# EAGLE design Segger_JTAG_OptoIso_v1p4 (EAGLE 9.6.2)
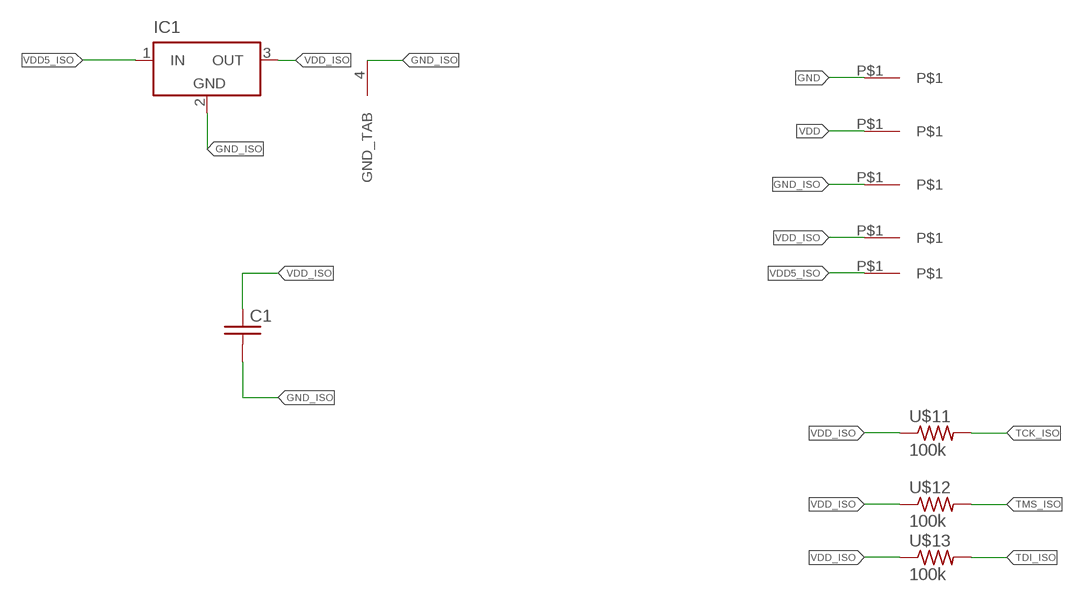
[diagram p0: schematic, sheet 1, part 1 of 2]
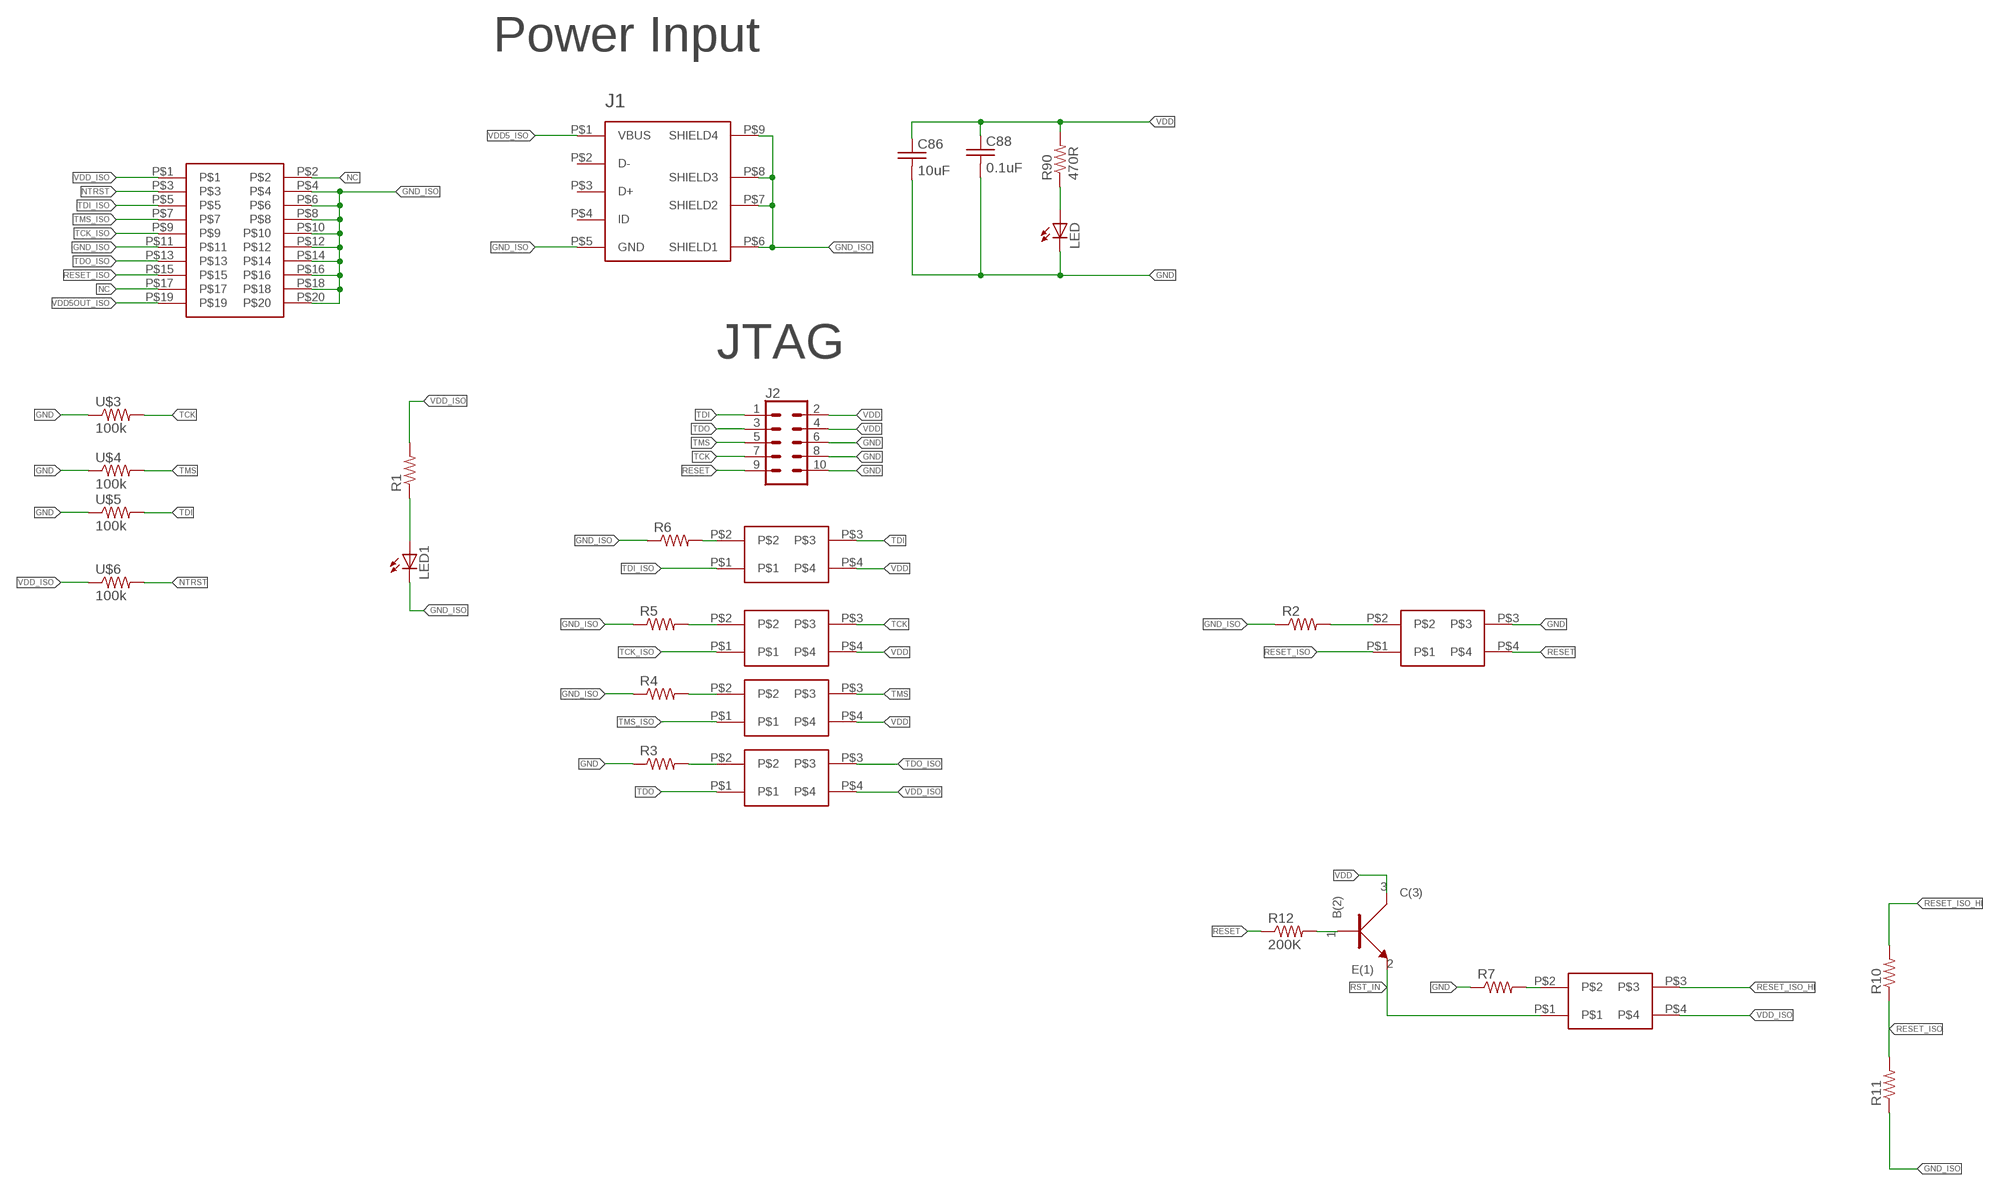
[diagram p1: schematic, sheet 1, part 2 of 2]

## Parts
C1  C_0805  [0805]
C86  10uF  C_0805  [0805]
C88  0.1uF  C_0805  [0805]
IC1  LT1129CST3  [SOT223]
J1  USB_MICRO-B  [USB_MICRO-B]
J2  CONN_05X2PTH  [2X5]
LED  LED_0805_GREEN  [LED_0805_GREEN]
LED1  LED_0805_GREEN  [LED_0805_GREEN]
P1  1_X_1_1MM_PIN  [1_X_1_1MM_PIN]
P2  1_X_1_1MM_PIN  [1_X_1_1MM_PIN]
P3  1_X_1_1MM_PIN  [1_X_1_1MM_PIN]
P4  1_X_1_1MM_PIN  [1_X_1_1MM_PIN]
P5  1_X_1_1MM_PIN  [1_X_1_1MM_PIN]
R1  R_0805  [0805]
R2  R_0805  [0805]
R3  R_0805  [0805]
R4  R_0805  [0805]
R5  R_0805  [0805]
R6  R_0805  [0805]
R7  R_0805  [0805]
R10  R_0805  [0805]
R11  R_0805  [0805]
R12  200K  R_0402  [0402]
R90  470R  R_0805  [0805]
U4  BC846BW  [SOT323]
U$1  OPTCOUPLER_PS2501L-1  [OPTOCOUPLER_PS2501L-1]
U$2  2_X_10_HEADER_GENERIC  [2_X_10_.1_INCH]
U$3  100k  R_0805  [0805]
U$4  100k  R_0805  [0805]
U$5  100k  R_0805  [0805]
U$6  100k  R_0805  [0805]
U$7  OPTCOUPLER_PS2501L-1  [OPTOCOUPLER_PS2501L-1]
U$8  OPTCOUPLER_PS2501L-1  [OPTOCOUPLER_PS2501L-1]
U$9  OPTCOUPLER_PS2501L-1  [OPTOCOUPLER_PS2501L-1]
U$10  OPTCOUPLER_PS2501L-1  [OPTOCOUPLER_PS2501L-1]
U$11  100k  R_0805  [0805]
U$12  100k  R_0805  [0805]
U$13  100k  R_0805  [0805]
U$14  OPTCOUPLER_PS2501L-1  [OPTOCOUPLER_PS2501L-1]

## Nets
GND: C86.2 C88.2 J2.6 J2.8 J2.10 LED.C P1.P$1 R3.1 R7.1 U$3.1 U$4.1 U$5.1 U$10.P$3
GND_ISO: C1.2 IC1.2(GND) IC1.4(GND_TAB) J1.P$5(GND) J1.P$6(SHIELD1) J1.P$7(SHIELD2) J1.P$8(SHIELD3) J1.P$9(SHIELD4) LED1.C P3.P$1 R2.1 R4.1 R5.1 R6.1 R11.1 U$2.P$4 U$2.P$6 U$2.P$8 U$2.P$10 U$2.P$11 U$2.P$12 U$2.P$14 U$2.P$16 U$2.P$18 U$2.P$20
N$1: LED1.A R1.1
N$2: R6.2 U$1.P$2
N$3: R5.2 U$7.P$2
N$4: R4.2 U$8.P$2
N$5: R3.2 U$9.P$2
N$6: R2.2 U$10.P$2
N$7: LED.A R90.1
N$8: R7.2 U$14.P$2
N$9: R12.P$2 U4.1(B(2))
NC: U$2.P$2 U$2.P$17
NTRST: U$2.P$3 U$6.2
RESET: J2.9 R12.P$1 U$10.P$4
RESET_ISO: R10.1 R11.2 U$2.P$15 U$10.P$1
RESET_ISO_HI: R10.2 U$14.P$3
RST_IN: U4.2(E(1)) U$14.P$1
TCK: J2.7 U$3.2 U$7.P$3
TCK_ISO: U$2.P$9 U$7.P$1 U$11.2
TDI: J2.1 U$1.P$3 U$5.2
TDI_ISO: U$1.P$1 U$2.P$5 U$13.2
TDO: J2.3 U$9.P$1
TDO_ISO: U$2.P$13 U$9.P$3
TMS: J2.5 U$4.2 U$8.P$3
TMS_ISO: U$2.P$7 U$8.P$1 U$12.2
VDD: C86.1 C88.1 J2.2 J2.4 P2.P$1 R90.2 U4.3(C(3)) U$1.P$4 U$7.P$4 U$8.P$4
VDD5_ISO: IC1.1(IN) J1.P$1(VBUS) P5.P$1
VDD5OUT_ISO: U$2.P$19
VDD_ISO: C1.1 IC1.3(OUT) P4.P$1 R1.2 U$2.P$1 U$6.1 U$9.P$4 U$11.1 U$12.1 U$13.1 U$14.P$4
Unconnected: J1.P$2(D-) J1.P$3(D+) J1.P$4(ID)

## Notes on the sheet
- Power Input
- JTAG

## Library data of the parts
C1 C86 C88 = 3D_MIG_Controller:C_0805
IC1 = 3D_MIG_Controller:LT1129CST3: VOLTAGE REGULATOR with shutdown
J1 = 3D_MIG_Controller:USB_MICRO-B
J2 = 3D_MIG_Controller:CONN_05X2: Multi connection point. Often used as Generic Header-pin footprint for 0.1 inch spaced/style header connections For AVR SPI programming port, see special device with nice symbol: "AVR_SPI_PROG_5x2.dev" You can populate with any combo of single row headers, but if you'd like an exact match, check these: 2x5 AVR ICSP Male Header <https://www.sparkfun.com/products/778> (PRT-00778) 2x5 Pin Shrouded Header <https://www.sparkfun.com/products/8506> (PRT-08506) On any of the 0.1 inch spaced packages, you can populate with these: Break Away Headers - Straight <https://www.sparkfun.com/products/116> (PRT-00116) Break Away Male Headers - Right Angle <https://www.sparkfun.com/products/553> (PRT-00553) Female Headers <https://www.sparkfun.com/products/115> (PRT-00115) Break Away Headers - Machine Pin <https://www.sparkfun.com/products/117> (PRT-00117) Break Away Female Headers - Swiss Machine Pin <https://www.sparkfun.com/products/743> (PRT-00743) Special note: the shrouded connector mates well with our 5x2 ribbon cables: 2x5 Pin IDC Ribbon Cable <https://www.sparkfun.com/products/8535> (PRT-08535); PROD_ID: CONN-08499; SF_ID: PRT-0778
LED LED1 = 3D_MIG_Controller:LED_0805_GREEN
P1-P5 = 3D_MIG_Controller:1_X_1_1MM_PIN
R1-R7 R10 R11 R90 U$3-U$6 U$11-U$13 = 3D_MIG_Controller:R_0805
R12 = 3D_MIG_Controller:R_0402
U4 = 3D_MIG_Controller:BC846BW; MANUFACTURER_PART_NUMBER: BC846BW; VENDOR: Nexperia
U$1 U$7-U$10 U$14 = 3D_MIG_Controller:OPTCOUPLER_PS2501L-1
U$2 = 3D_MIG_Controller:2_X_10_HEADER_GENERIC

## Board
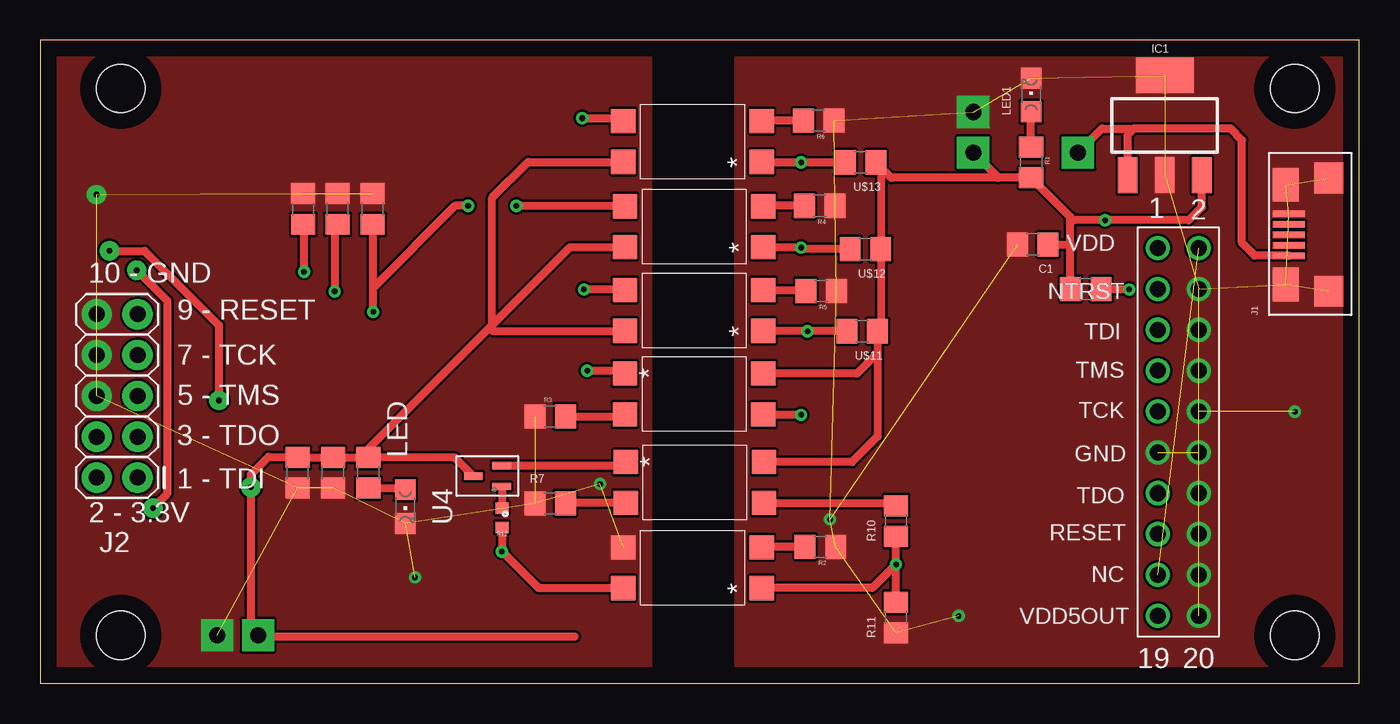
[diagram p2: board, top side]
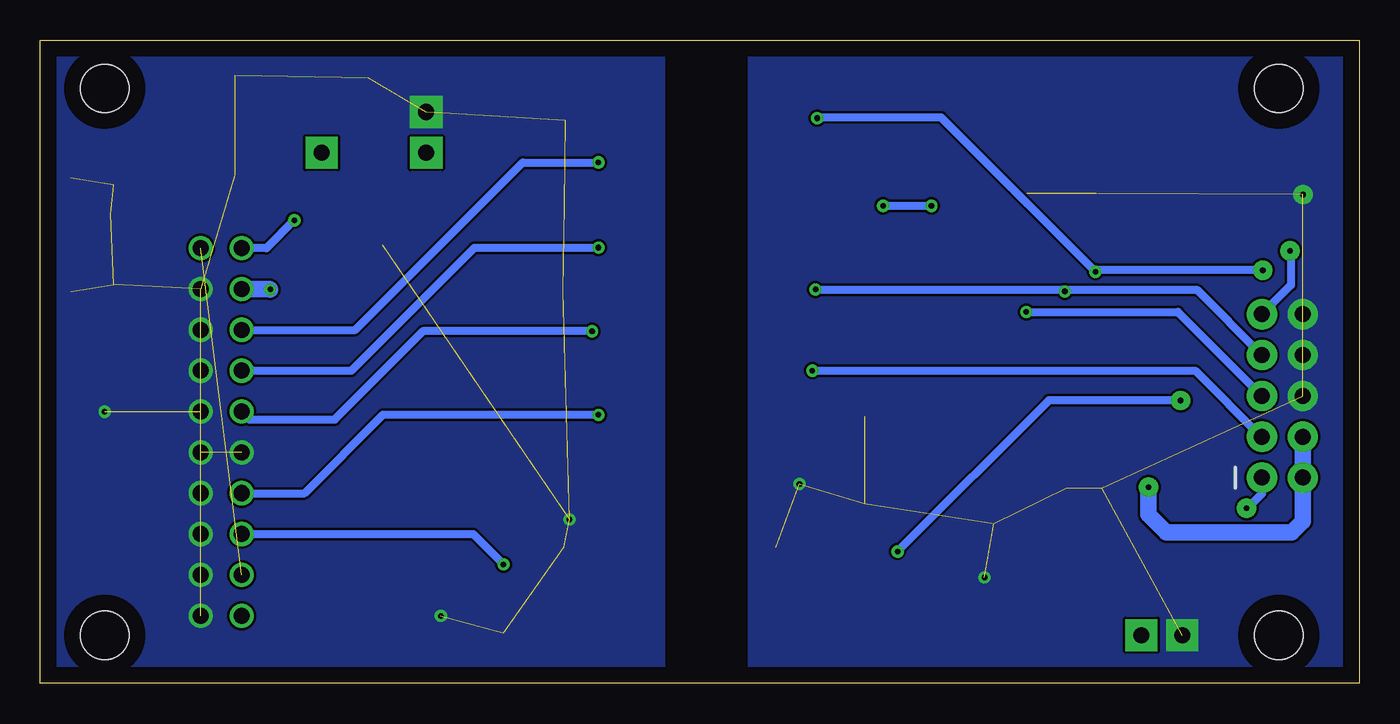
[diagram p3: board, bottom side, seen from below]

Size 82 x 40 mm. Coordinates in mm from the lower left corner, seen from the top.
Outline: 0,0 82,0 82,40 0,40 0,0
Copper layers (1*16): Top 0.035mm / dielectric 1.5mm / Bottom 0.035mm
Design rules "default": minimum track width 6mil, minimum drill 0.35mm, track to track 6mil, track to pad 6mil, pad to pad 6mil, via to via 6mil, smd to smd 6mil, copper to edge 40mil, drill to drill 6mil, minimum pad ring 10mil, minimum via ring 8mil, stop-mask expansion 4mil, vias tented up to drill 0mil, thermal gap 10mil
Holes 3 mm at 5,37 78,37 78,3 5,3

### Footprints (pad centres in the part's own frame; a part is rotated, then mirrored left to right if it is on the bottom)
0805 = smd 1.3 x 1.5: 1 -0.95,0; 2 0.95,0
SOT223 = smd 1.219 x 2.235: 1 -2.311,-3.099; 2 0,-3.099; 3 2.311,-3.099 | smd 3.6 x 2.2: 4 0,3.099
USB_MICRO-B = smd 0.4 x 2: P$1 -1.3,2.475; P$2 -0.65,2.475; P$3 0,2.475; P$4 0.65,2.475; P$5 1.3,2.475 | smd 2.1 x 1.6: P$6 -3.1,2.675; P$7 3.1,2.675 | smd 1.9 x 1.8: P$8 -3.525,0; P$9 3.525,0
2X5 = drill 1 pad 1.88: 1 0,0; 2 0,2.54; 3 2.54,0; 4 2.54,2.54; 5 5.08,0; 6 5.08,2.54; 7 7.62,0; 8 7.62,2.54; 9 10.16,0; 10 10.16,2.54
LED_0805_GREEN = smd 1.3 x 1.3: A 0,-1.05; C 0,1.05
1_X_1_1MM_PIN = drill 1 pad 2 square: P$1 0,0
0402 = smd 0.8 x 0.7: P$1 0,0.6; P$2 0,-0.6
SOT323 = smd 0.457 x 1.168: 1 -0.65,-0.876; 2 0.65,-0.876; 3 0,0.876
OPTOCOUPLER_PS2501L-1 = smd 1.5 x 1.5: P$1 -1.27,-4.3; P$2 1.27,-4.3; P$3 1.27,4.3; P$4 -1.27,4.3
2_X_10_.1_INCH = drill 1: P$1 -11.43,-1.27; P$2 -11.43,1.27; P$3 -8.89,-1.27; P$4 -8.89,1.27; P$5 -6.35,-1.27; P$6 -6.35,1.27; P$7 -3.81,-1.27; P$8 -3.81,1.27; P$9 -1.27,-1.27; P$10 -1.27,1.27; P$11 1.27,-1.27; P$12 1.27,1.27; P$13 3.81,-1.27; P$14 3.81,1.27; P$15 6.35,-1.27; P$16 6.35,1.27; P$17 8.89,-1.27; P$18 8.89,1.27; P$19 11.43,-1.27; P$20 11.43,1.27

### Placement (x,y rotation side)
C1  61.7,27.3 180 top
C86  18.2,13.1 270 top
C88  16,13.1 270 top
IC1  69.9,34.7 0 top
J1  80.1,27.9 90 top
J2  6.05,12.8 90 top
LED  22.7,11 180 top
LED1  61.6,36.6 0 top
P1  11,3 0 top
P2  13.54,3 0 top
P3  58,35.54 0 top
P4  58,33 0 top
P5  64.5,33 0 top
R1  61.6,32.4 270 top
R2  48.5,8.5 180 top
R3  31.7,16.6 0 top
R4  48.45,29.7 180 top
R5  48.55,24.4 180 top
R6  48.4,35 180 top
R7  31.7,11.2 0 top
R10  53.2,10.1 90 top
R11  53.2,4.1 90 top
R12  28.7,10.3 180 top
R90  20.4,13.1 90 top
U4  27.8,12.9 90 top
U$1  40.55,33.7 90 top
U$2  70.75,15.64 270 top
U$3  18.49,29.5 270 top
U$4  20.67,29.5 270 top
U$5  16.35,29.5 270 top
U$6  65,24.53 0 top
U$7  40.65,23.2 90 top
U$8  40.65,28.4 90 top
U$9  40.65,18 270 top
U$10  40.55,7.2 90 top
U$11  51.1,21.9 180 top
U$12  51.3,27 180 top
U$13  51,32.4 180 top
U$14  40.7,12.5 270 top

### Tracks (layer width: path | path; a pad name or v marks a point on that pad's centre or on a via)
GND  (via drill 0.35, 0.35 pad 1.2)  (15 unrouted)
  other vias: 3.5,30.4 23.3,6.6 34.8,12.4
  pour Top (no thermals): 0,40.1 38,40.1 38,0 0,0
  pour Bottom (no thermals): 0,40.1 38,40.1 38,0 0,0
GND_ISO  (via drill 0.35)  (27 unrouted)
  other vias: 57.1,4.2 78,16.9 49.1,10.2
  pour Bottom (no thermals): 82,40 43.2,40 43.2,0 82,0
  pour Top (no thermals): 82,40 82,0 43.2,0 43.2,40
N$1
  Top 0.508: R1.1 LED1.A
N$2
  Top 0.508: R6.2 44.88,35 U$1.P$2
N$3
  Top 0.508: R5.2 47.53,24.47 U$7.P$2
N$4
  Top 0.508: R4.2 44.98,29.7 U$8.P$2
N$5
  Top 0.508: U$9.P$2 36.22,16.6 R3.2
N$6
  Top 0.508: R2.2 44.88,8.5 U$10.P$2
N$7
  Top 0.508: R90.1 22.6,12.15 LED.A
N$8
  Top 0.508: U$14.P$2 32.68,11.23 R7.2
N$9
  Top 0.508: U4.1 28.7,12.23 R12.P$2
NC  (1 unrouted)
NTRST  (via drill 0.35)
  Top 0.508: v67.7,24.5 65.98,24.5 U$6.2
  Bottom 1.016: U$2.P$3 67.73,24.53 v67.7,24.5
RESET  (via drill 0.35, 0.35 pad 1.2)
  Top 0.508: v11.1,17.6 11.1,22.3 6.5,26.9 v4.3,26.9 | R12.P$1 v28.7,8.2 30.97,5.93 U$10.P$4
  Bottom 0.508: 4.18,27.02 v4.3,26.9 4.25,26.85 4.25,24.76 J2.9 | v11.1,17.6 19.3,17.6 v28.7,8.2
RESET_ISO  (via drill 0.35)
  Top 0.508: 44.85,5.9 U$10.P$1 51.73,5.93 v53.2,7.4 | v53.2,7.4 R10.1 | R11.2 v53.2,7.4
  Bottom 0.508: v53.2,7.4 55.09,9.29 U$2.P$15
RESET_ISO_HI
  Top 0.508: U$14.P$3 53.02,11.23 R10.2
RST_IN
  Top 0.508: 36.15,13.52 U$14.P$1 36.18,13.55 U4.2
TCK  (via drill 0.35)
  Top 0.508: U$7.P$3 36.32,24.5 v33.8,24.5 | U$3.2 18.3,28.36 v18.3,24.38
  Bottom 0.508: J2.7 10.11,24.48 18.2,24.48 v18.3,24.38 18.42,24.5 v33.8,24.5
TCK_ISO  (via drill 0.35)
  Top 0.508: U$7.P$1 44.98,21.9 v47.7,21.9 U$11.2
  Bottom 0.508: U$2.P$9 68.98,16.41 63.69,16.41 58.2,21.9 v47.7,21.9
TDI  (via drill 0.35, 0.35 pad 1.2)
  Top 0.508: v6,25.7 7.9,23.8 7.9,11.8 v7,10.9 | v33.7,35.15 36.43,35.15 U$1.P$3 | v16.4,25.6 16.4,28.5 U$5.2
  Bottom 0.508: 6.05,25.65 v6,25.7 16.3,25.7 v16.4,25.6 26,35.2 33.65,35.2 v33.7,35.15 | v7,10.9 6.95,10.9 6.05,11.8 J2.1
TDI_ISO  (via drill 0.35)
  Top 0.508: U$1.P$1 44.88,32.4 v47.3,32.4 U$13.2
  Bottom 0.508: U$2.P$5 62.41,21.99 52,32.4 v47.3,32.4
TDO  (via drill 0.35)
  Top 0.508: v34,19.45 36.35,19.45 U$9.P$1
  Bottom 0.508: 6.09,15.3 J2.3 6.09,15.34 10.2,19.45 v34,19.45
TDO_ISO  (via drill 0.35)
  Top 0.508: v47.3,16.7 44.98,16.7 U$9.P$3
  Bottom 0.508: U$2.P$13 65.57,11.83 60.7,16.7 v47.3,16.7
TMS  (via drill 0.35)
  Top 0.508: v20.7,23.1 20.7,24.6 | 20.7,24.6 20.7,28.52 | U$8.P$3 29.63,29.67 v29.6,29.7 | v26.6,29.7 25.8,29.7 20.7,24.6
  Top 1.016: 20.7,28.52 U$4.2
  Bottom 0.508: J2.5 11.27,23.1 v20.7,23.1 | v29.6,29.7 v26.6,29.7
TMS_ISO  (via drill 0.35)
  Top 0.508: U$8.P$1 44.98,27.1 v47.3,27.1 47.4,27 U$12.2
  Bottom 0.508: U$2.P$7 62.65,19.45 55,27.1 v47.3,27.1
VDD  (via drill 0.35 pad 1.2)
  Top 0.508: R90.2 20.4,14.6 28.1,22.3 | 28.1,22.3 28.1,30.2 30.33,32.43 U$1.P$4 | 28.1,22.3 32.93,27.13 U$8.P$4 | 28.1,22.3 28.1,21.93 U$7.P$4 | R90.2 C86.1 C88.1 15.95,14.1 14.2,14.1 13.1,13 v13.1,12.2 13.1,3.44 P2.P$1 13.64,2.9 33.22,2.9 | U4.3 25.77,14.05 R90.2
  Bottom 1.016: v13.1,12.2 13.1,10.5 12,9.4 4.2,9.4 3.51,10.09 J2.2 J2.4
VDD5_ISO
  Top 0.508: J1.P$1 75.5,26.6 74.7,27.4 74.7,33.8 74,34.5 68,34.5 | 68,34.5 67.59,34.09 IC1.1 | P5.P$1 66,34.5 68,34.5
VDD_ISO  (via drill 0.35)
  Top 0.508: 64.05,29 64.25,28.8 v66.2,28.8 71.4,28.8 72.21,29.61 IC1.3 | 64.05,29 R1.2 | U$6.1 64.05,27.3 | 64.05,27.3 64.05,29 | R1.2 52.9,31.45 U$13.1 52.25,32.1 U$12.1 52.25,22.1 U$11.1 | U$11.1 52.05,20.55 50.77,19.27 U$9.P$4 | U$11.1 52.05,15.35 50.47,13.77 U$14.P$4 | R1.2 59.55,31.45 P4.P$1 | C1.1 64.05,27.3
  Bottom 0.508: v66.2,28.8 67.93,27.07 U$2.P$1

### Text on the board
tPlace: 1 | 2 | VDD | 10 - GND | NTRST | 9 - RESET | TDI | 7 - TCK | TMS | TCK | 5 - TMS | 3 - TDO | GND | 1 - TDI | TDO | 2 - 3.3V | RESET | NC | VDD5OUT | 19 | 20